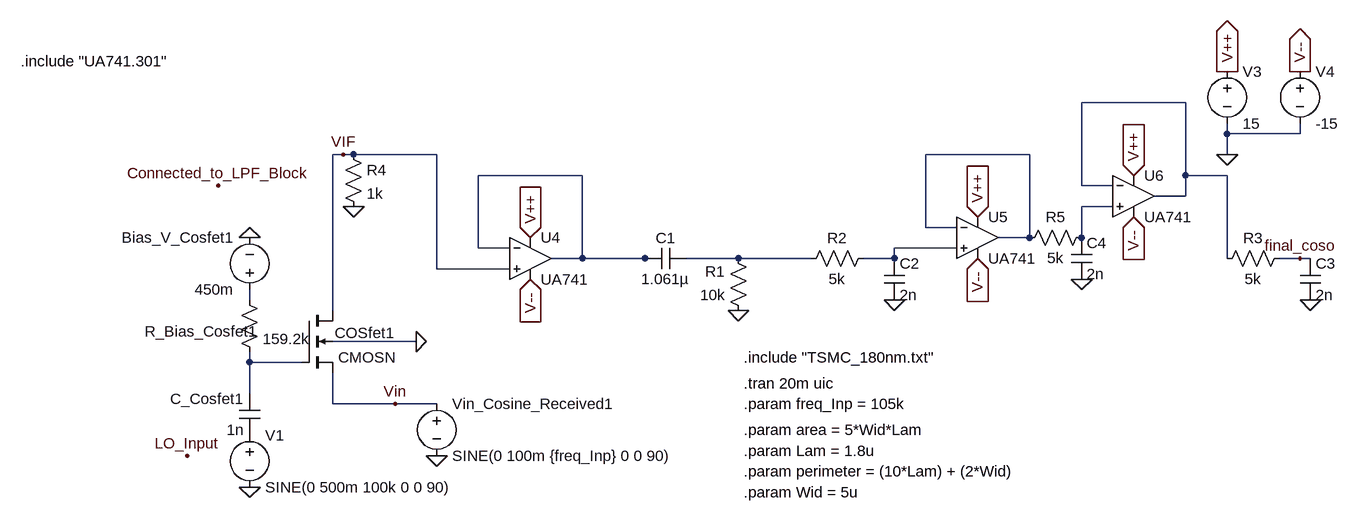
[diagram p0: schematic Draft1.asc]
Draft1.asc, the LTspice schematic file:
Version 4
SHEET 1 3512 1092
WIRE 1168 -128 1008 -128
WIRE 1232 -80 1232 -96
WIRE 1344 -80 1344 -96
WIRE 1344 -80 1232 -80
WIRE -128 -48 -144 -48
WIRE -112 -48 -128 -48
WIRE 16 -48 -112 -48
WIRE 928 -48 768 -48
WIRE 1232 -48 1232 -80
WIRE 240 -16 80 -16
WIRE 1168 -16 1168 -128
WIRE 1232 -16 1168 -16
WIRE 1008 0 1008 -128
WIRE 1056 0 1008 0
WIRE 1168 16 1168 -16
WIRE 1168 16 1120 16
WIRE 1056 32 1008 32
WIRE 768 64 768 -48
WIRE 816 64 768 64
WIRE 928 80 928 -48
WIRE 928 80 880 80
WIRE 1008 80 1008 32
WIRE 80 96 80 -16
WIRE 128 96 80 96
WIRE 816 96 720 96
WIRE 240 112 240 -16
WIRE 240 112 192 112
WIRE 336 112 240 112
WIRE 352 112 336 112
WIRE 480 112 400 112
WIRE 592 112 480 112
WIRE 720 112 720 96
WIRE 720 112 672 112
WIRE 1232 112 1232 -16
WIRE 1344 112 1312 112
WIRE 1360 112 1344 112
WIRE 16 128 16 -48
WIRE 128 128 16 128
WIRE -272 176 -272 160
WIRE -144 192 -144 -48
WIRE -16 240 -144 240
WIRE -272 272 -272 256
WIRE -192 272 -272 272
WIRE -272 320 -272 272
WIRE -144 336 -144 288
WIRE -48 336 -144 336
WIRE 16 336 -48 336
FLAG -272 80 0
FLAG 16 416 0
FLAG -16 240 0
FLAG -368 416 LO_Input
FLAG -320 0 Connected_to_LPF_Block
FLAG -272 464 0
FLAG -112 32 0
FLAG -48 336 Vin
FLAG -128 -48 VIF
FLAG 1232 -48 0
FLAG 1232 -176 V++
IOPIN 1232 -176 Out
FLAG 1344 -176 V--
IOPIN 1344 -176 Out
FLAG 720 176 0
FLAG 480 192 0
FLAG 1360 176 0
FLAG 160 80 V++
IOPIN 160 80 In
FLAG 160 144 V--
IOPIN 160 144 In
FLAG 848 48 V++
IOPIN 848 48 In
FLAG 848 112 V--
IOPIN 848 112 In
FLAG 1008 144 0
FLAG 1088 -16 V++
IOPIN 1088 -16 In
FLAG 1088 48 V--
IOPIN 1088 48 In
FLAG 1344 112 final_coso
SYMBOL cap -256 384 R180
WINDOW 0 24 56 Left 2
WINDOW 3 24 8 Left 2
SYMATTR InstName C_Cosfet1
SYMATTR Value 1n
SYMBOL res -288 160 R0
WINDOW 0 -145 64 Left 2
SYMATTR InstName R_Bias_Cosfet1
SYMATTR Value 159.2k
SYMBOL voltage -272 176 R180
WINDOW 0 24 96 Left 2
WINDOW 3 24 16 Left 2
WINDOW 123 0 0 Left 0
WINDOW 39 0 0 Left 0
SYMATTR InstName Bias_V_Cosfet1
SYMATTR Value 450m
SYMBOL nmos4 -192 192 R0
WINDOW 0 51 35 Left 2
SYMATTR InstName COSfet1
SYMATTR Value CMOSN
SYMATTR Value2 l={2*Lam} w={1*Wid} ad={5*Wid*Lam} as={5*Wid*Lam} pd={perimeter} ps={perimeter}
SYMBOL voltage 16 320 R0
WINDOW 123 0 0 Left 0
WINDOW 39 0 0 Left 0
SYMATTR InstName Vin_Cosine_Received1
SYMATTR Value SINE(0 100m {freq_Inp} 0 0 90)
SYMBOL voltage -272 368 R0
WINDOW 123 0 0 Left 0
WINDOW 39 0 0 Left 0
SYMATTR InstName V1
SYMATTR Value SINE(0 500m 100k 0 0 90)
SYMBOL res -128 -64 R0
SYMATTR InstName R4
SYMATTR Value 1k
SYMBOL voltage 1232 -192 R0
WINDOW 123 0 0 Left 0
WINDOW 39 0 0 Left 0
SYMATTR InstName V3
SYMATTR Value 15
SYMBOL voltage 1344 -192 R0
WINDOW 123 0 0 Left 0
WINDOW 39 0 0 Left 0
SYMATTR InstName V4
SYMATTR Value -15
SYMBOL res 496 208 R180
WINDOW 0 36 76 Left 2
WINDOW 3 36 40 Left 2
SYMATTR InstName R1
SYMATTR Value 10k
SYMBOL cap 400 96 R90
WINDOW 0 0 32 VBottom 2
WINDOW 3 32 32 VTop 2
SYMATTR InstName C1
SYMATTR Value 1.061µ
SYMBOL res 688 96 R90
WINDOW 0 0 56 VBottom 2
WINDOW 3 32 56 VTop 2
SYMATTR InstName R2
SYMATTR Value 5k
SYMBOL cap 704 112 R0
SYMATTR InstName C2
SYMATTR Value 2n
SYMBOL res 1328 96 R90
WINDOW 0 0 56 VBottom 2
WINDOW 3 32 56 VTop 2
SYMATTR InstName R3
SYMATTR Value 5k
SYMBOL cap 1344 112 R0
SYMATTR InstName C3
SYMATTR Value 2n
SYMBOL OpAmps\\opamp2 160 48 R0
SYMATTR InstName U4
SYMATTR Value UA741
SYMBOL OpAmps\\opamp2 848 16 R0
SYMATTR InstName U5
SYMATTR Value UA741
SYMBOL res 1024 64 R90
WINDOW 0 0 56 VBottom 2
WINDOW 3 32 56 VTop 2
SYMATTR InstName R5
SYMATTR Value 5k
SYMBOL cap 992 80 R0
SYMATTR InstName C4
SYMATTR Value 2n
SYMBOL OpAmps\\opamp2 1088 -48 R0
SYMATTR InstName U6
SYMATTR Value UA741
TEXT 488 264 Left 2 !.include "TSMC_180nm.txt"
TEXT 488 304 Left 2 !.tran 20m uic
TEXT 488 336 Left 2 !.param freq_Inp = 105k
TEXT 488 440 Left 2 !.param perimeter = (10*Lam) + (2*Wid)
TEXT 488 408 Left 2 !.param Lam = 1.8u
TEXT 488 472 Left 2 !.param Wid = 5u
TEXT 488 376 Left 2 !.param area = 5*Wid*Lam
TEXT -624 -192 Left 2 !.include "UA741.301"

The netlist it stands for:
* Draft1.asc
C_Cosfet1 P001 N008 1n
R_Bias_Cosfet1 N007 N008 159.2k
V§Bias_V_Cosfet1 N007 0 450m
M§COSfet1 VIF N008 Vin 0 CMOSN l={2*Lam} w={1*Wid} ad={5*Wid*Lam} as={5*Wid*Lam} pd={perimeter} ps={perimeter}
Vin_Cosine_Received1 Vin 0 SINE(0 100m {freq_Inp} 0 0 90)
V1 P001 0 SINE(0 500m 100k 0 0 90)
R4 VIF 0 1k
V3 V++ 0 15
V4 V-- 0 -15
R1 0 N006 10k
C1 N006 N003 1.061µ
R2 N005 N006 5k
C2 N005 0 2n
R3 final_coso N001 5k
C3 final_coso 0 2n
XU4 VIF N003 V++ V-- N003 UA741  ; pins In+ In- V+ V- OUT
XU5 N005 N002 V++ V-- N002 UA741  ; pins In+ In- V+ V- OUT
R5 N004 N002 5k
C4 N004 0 2n
XU6 N004 N001 V++ V-- N001 UA741  ; pins In+ In- V+ V- OUT
.model NMOS NMOS
.model PMOS PMOS
.lib standard.mos
.include "TSMC_180nm.txt"
.tran 20m uic
.param freq_Inp = 105k
.param perimeter = (10*Lam) + (2*Wid)
.param Lam = 1.8u
.param Wid = 5u
.param area = 5*Wid*Lam
.include "UA741.301"
.backanno
.end